# Altium schematic sheet Lights.SchDoc
size 594 x 420 mm; SheetNumber: 4; SheetTotal: 11; SPICEModelCacheKKOZVZNQ: <root> / <DocumentId>KKOZVZNQ</DocumentId> / <CacheFrame Number="0"> / <Model Name="0402_885012205018_100nf" Kind="CKT"> / <Text>******* / .subckt 0402_885012205018_100nF 1 2 / Rser 1 3 0.0183525691398 / Lser 2 4 3.07541467E-10 / C1 3 4 0.0000001 / Rpar 3 4 5000000000 / .ends 0402_885012205018_100nF</Text> / </Model> / </CacheFrame> / </root>
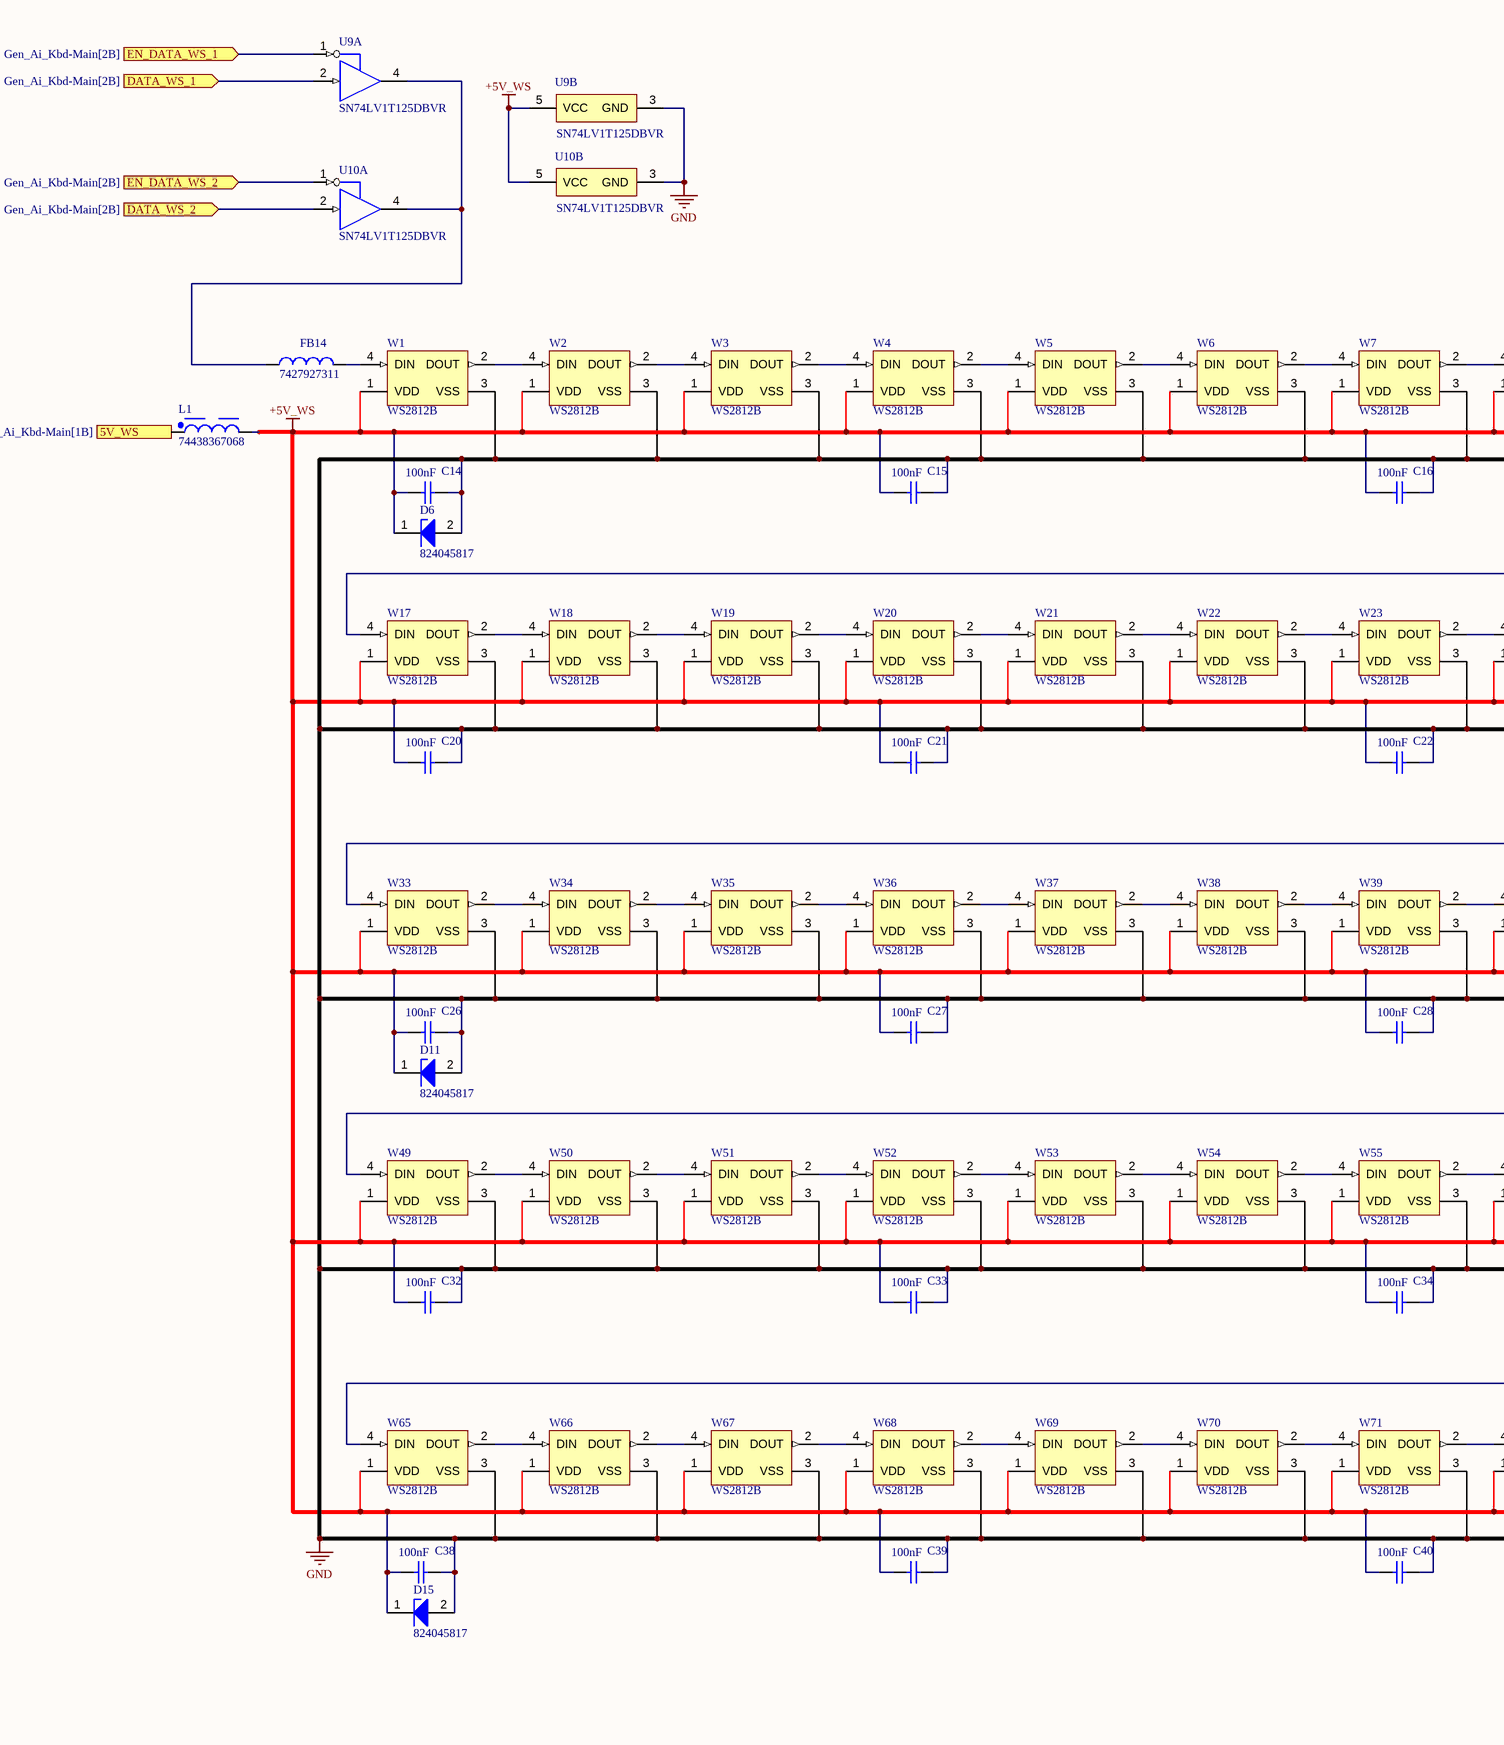
[diagram p0: Lights.SchDoc, left]
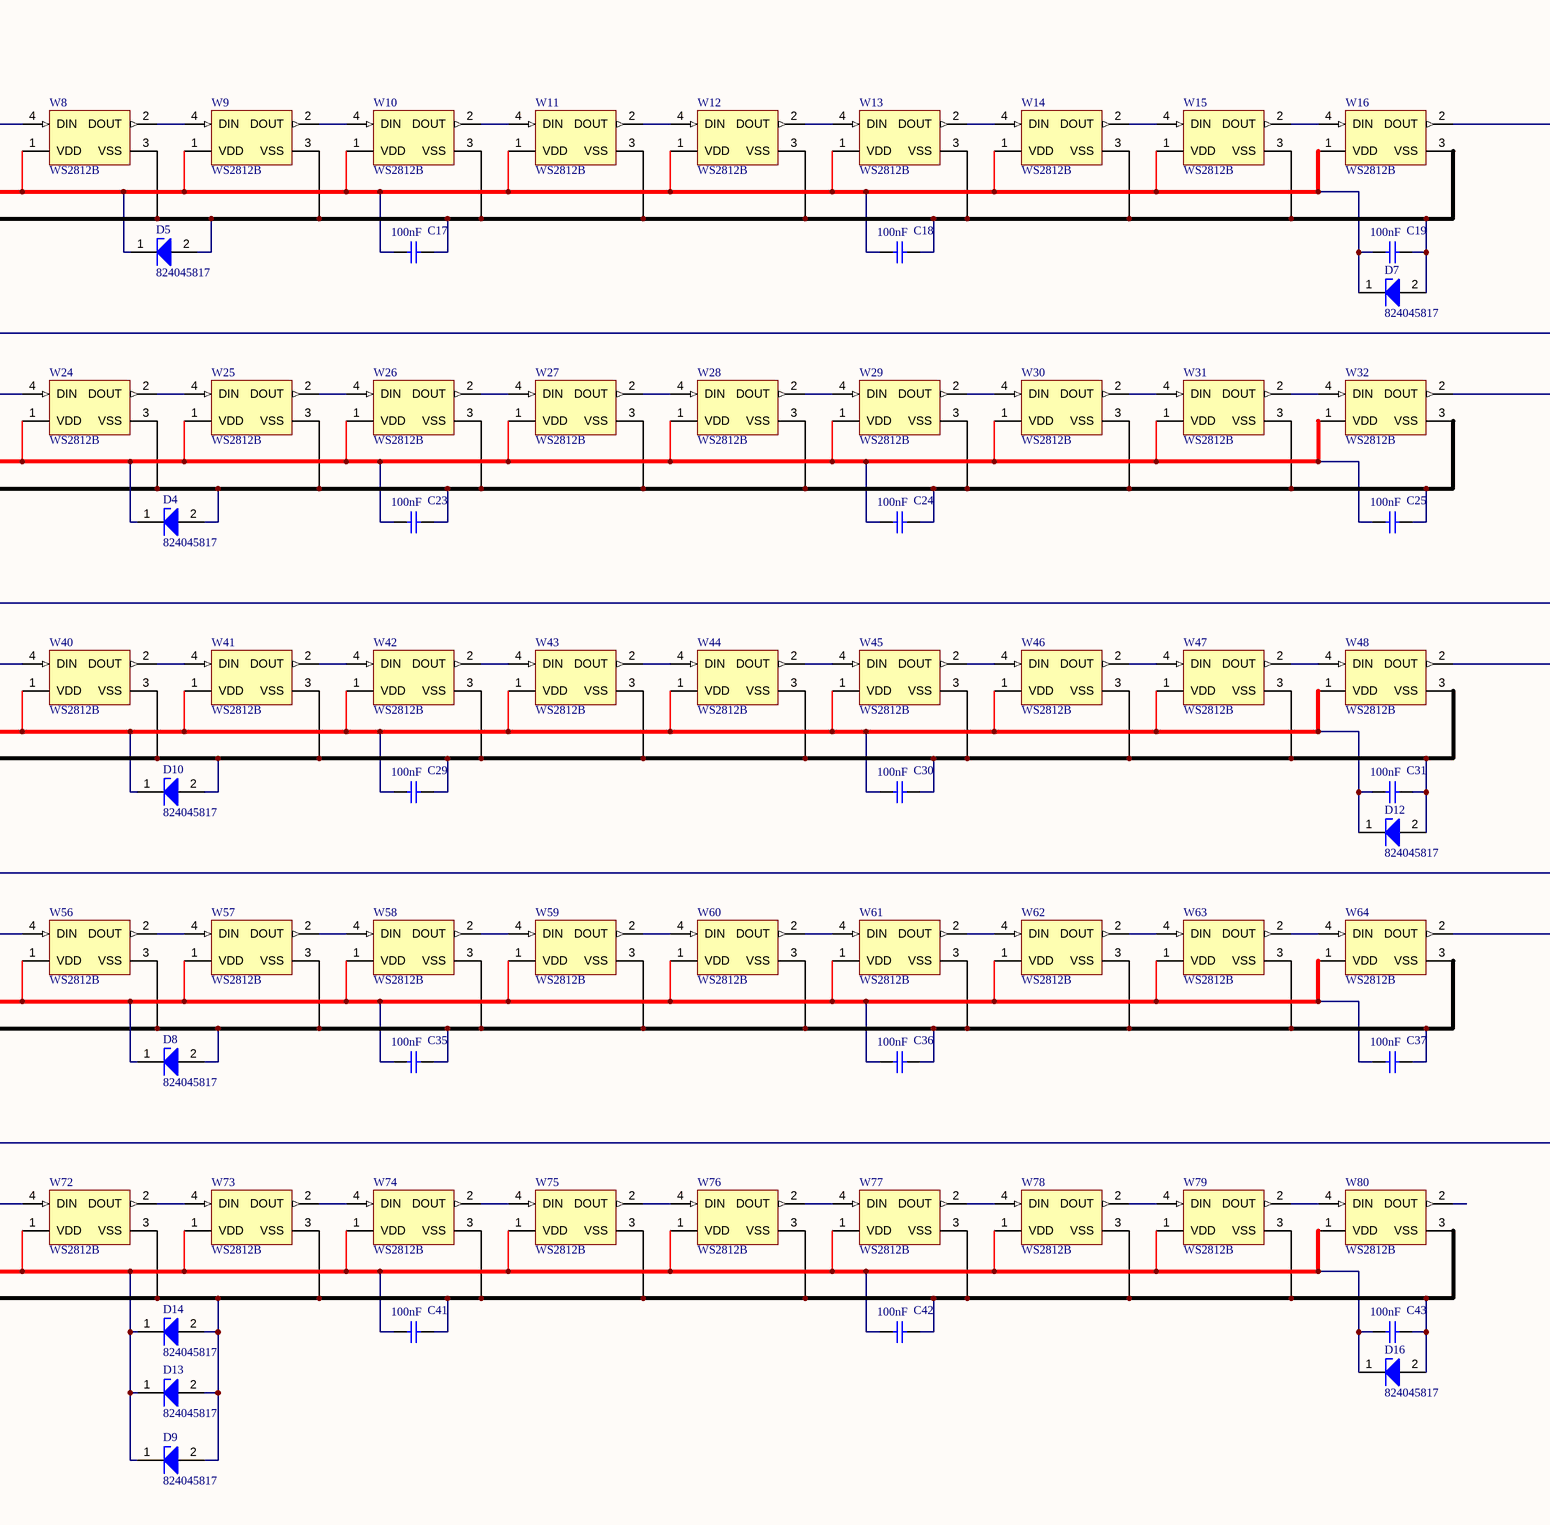
[diagram p1: Lights.SchDoc, right]

## Parts
C14  Capacitance: 100nF  [WCAP-CSGP_0402_L1W0.5H0.5]  (hidden comment: 885012205018)
C15  Capacitance: 100nF  [WCAP-CSGP_0402_L1W0.5H0.5]  (hidden comment: 885012205018)
C16  Capacitance: 100nF  [WCAP-CSGP_0402_L1W0.5H0.5]  (hidden comment: 885012205018)
C17  Capacitance: 100nF  [WCAP-CSGP_0402_L1W0.5H0.5]  (hidden comment: 885012205018)
C18  Capacitance: 100nF  [WCAP-CSGP_0402_L1W0.5H0.5]  (hidden comment: 885012205018)
C19  Capacitance: 100nF  [WCAP-CSGP_0402_L1W0.5H0.5]  (hidden comment: 885012205018)
C20  Capacitance: 100nF  [WCAP-CSGP_0402_L1W0.5H0.5]  (hidden comment: 885012205018)
C21  Capacitance: 100nF  [WCAP-CSGP_0402_L1W0.5H0.5]  (hidden comment: 885012205018)
C22  Capacitance: 100nF  [WCAP-CSGP_0402_L1W0.5H0.5]  (hidden comment: 885012205018)
C23  Capacitance: 100nF  [WCAP-CSGP_0402_L1W0.5H0.5]  (hidden comment: 885012205018)
C24  Capacitance: 100nF  [WCAP-CSGP_0402_L1W0.5H0.5]  (hidden comment: 885012205018)
C25  Capacitance: 100nF  [WCAP-CSGP_0402_L1W0.5H0.5]  (hidden comment: 885012205018)
C26  Capacitance: 100nF  [WCAP-CSGP_0402_L1W0.5H0.5]  (hidden comment: 885012205018)
C27  Capacitance: 100nF  [WCAP-CSGP_0402_L1W0.5H0.5]  (hidden comment: 885012205018)
C28  Capacitance: 100nF  [WCAP-CSGP_0402_L1W0.5H0.5]  (hidden comment: 885012205018)
C29  Capacitance: 100nF  [WCAP-CSGP_0402_L1W0.5H0.5]  (hidden comment: 885012205018)
C30  Capacitance: 100nF  [WCAP-CSGP_0402_L1W0.5H0.5]  (hidden comment: 885012205018)
C31  Capacitance: 100nF  [WCAP-CSGP_0402_L1W0.5H0.5]  (hidden comment: 885012205018)
C32  Capacitance: 100nF  [WCAP-CSGP_0402_L1W0.5H0.5]  (hidden comment: 885012205018)
C33  Capacitance: 100nF  [WCAP-CSGP_0402_L1W0.5H0.5]  (hidden comment: 885012205018)
C34  Capacitance: 100nF  [WCAP-CSGP_0402_L1W0.5H0.5]  (hidden comment: 885012205018)
C35  Capacitance: 100nF  [WCAP-CSGP_0402_L1W0.5H0.5]  (hidden comment: 885012205018)
C36  Capacitance: 100nF  [WCAP-CSGP_0402_L1W0.5H0.5]  (hidden comment: 885012205018)
C37  Capacitance: 100nF  [WCAP-CSGP_0402_L1W0.5H0.5]  (hidden comment: 885012205018)
C38  Capacitance: 100nF  [WCAP-CSGP_0402_L1W0.5H0.5]  (hidden comment: 885012205018)
C39  Capacitance: 100nF  [WCAP-CSGP_0402_L1W0.5H0.5]  (hidden comment: 885012205018)
C40  Capacitance: 100nF  [WCAP-CSGP_0402_L1W0.5H0.5]  (hidden comment: 885012205018)
C41  Capacitance: 100nF  [WCAP-CSGP_0402_L1W0.5H0.5]  (hidden comment: 885012205018)
C42  Capacitance: 100nF  [WCAP-CSGP_0402_L1W0.5H0.5]  (hidden comment: 885012205018)
C43  Capacitance: 100nF  [WCAP-CSGP_0402_L1W0.5H0.5]  (hidden comment: 885012205018)
D4  824045817  [WE-TVS_DFN1610-2L]
D5  824045817  [WE-TVS_DFN1610-2L]
D6  824045817  [WE-TVS_DFN1610-2L]
D7  824045817  [WE-TVS_DFN1610-2L]
D8  824045817  [WE-TVS_DFN1610-2L]
D9  824045817  [WE-TVS_DFN1610-2L]
D10  824045817  [WE-TVS_DFN1610-2L]
D11  824045817  [WE-TVS_DFN1610-2L]
D12  824045817  [WE-TVS_DFN1610-2L]
D13  824045817  [WE-TVS_DFN1610-2L]
D14  824045817  [WE-TVS_DFN1610-2L]
D15  824045817  [WE-TVS_DFN1610-2L]
D16  824045817  [WE-TVS_DFN1610-2L]
FB14  7427927311  [WE-CBF_0402_L1W0.5H0.5_HC]
L1  74438367068  [WE-MAPI_5030]
U9  SN74LV1T125DBVR  [DBV0005A_M]  (parts A,B of 2)
U10  SN74LV1T125DBVR  [DBV0005A_M]  (parts A,B of 2)
W1  WS2812B  [ADA-RGB-1655_V]
W2  WS2812B  [ADA-RGB-1655_V]
W3  WS2812B  [ADA-RGB-1655_V]
W4  WS2812B  [ADA-RGB-1655_V]
W5  WS2812B  [ADA-RGB-1655_V]
W6  WS2812B  [ADA-RGB-1655_V]
W7  WS2812B  [ADA-RGB-1655_V]
W8  WS2812B  [ADA-RGB-1655_V]
W9  WS2812B  [ADA-RGB-1655_V]
W10  WS2812B  [ADA-RGB-1655_V]
W11  WS2812B  [ADA-RGB-1655_V]
W12  WS2812B  [ADA-RGB-1655_V]
W13  WS2812B  [ADA-RGB-1655_V]
W14  WS2812B  [ADA-RGB-1655_V]
W15  WS2812B  [ADA-RGB-1655_V]
W16  WS2812B  [ADA-RGB-1655_V]
W17  WS2812B  [ADA-RGB-1655_V]
W18  WS2812B  [ADA-RGB-1655_V]
W19  WS2812B  [ADA-RGB-1655_V]
W20  WS2812B  [ADA-RGB-1655_V]
W21  WS2812B  [ADA-RGB-1655_V]
W22  WS2812B  [ADA-RGB-1655_V]
W23  WS2812B  [ADA-RGB-1655_V]
W24  WS2812B  [ADA-RGB-1655_V]
W25  WS2812B  [ADA-RGB-1655_V]
W26  WS2812B  [ADA-RGB-1655_V]
W27  WS2812B  [ADA-RGB-1655_V]
W28  WS2812B  [ADA-RGB-1655_V]
W29  WS2812B  [ADA-RGB-1655_V]
W30  WS2812B  [ADA-RGB-1655_V]
W31  WS2812B  [ADA-RGB-1655_V]
W32  WS2812B  [ADA-RGB-1655_V]
W33  WS2812B  [ADA-RGB-1655_V]
W34  WS2812B  [ADA-RGB-1655_V]
W35  WS2812B  [ADA-RGB-1655_V]
W36  WS2812B  [ADA-RGB-1655_V]
W37  WS2812B  [ADA-RGB-1655_V]
W38  WS2812B  [ADA-RGB-1655_V]
W39  WS2812B  [ADA-RGB-1655_V]
W40  WS2812B  [ADA-RGB-1655_V]
W41  WS2812B  [ADA-RGB-1655_V]
W42  WS2812B  [ADA-RGB-1655_V]
W43  WS2812B  [ADA-RGB-1655_V]
W44  WS2812B  [ADA-RGB-1655_V]
W45  WS2812B  [ADA-RGB-1655_V]
W46  WS2812B  [ADA-RGB-1655_V]
W47  WS2812B  [ADA-RGB-1655_V]
W48  WS2812B  [ADA-RGB-1655_V]
W49  WS2812B  [ADA-RGB-1655_V]
W50  WS2812B  [ADA-RGB-1655_V]
W51  WS2812B  [ADA-RGB-1655_V]
W52  WS2812B  [ADA-RGB-1655_V]
W53  WS2812B  [ADA-RGB-1655_V]
W54  WS2812B  [ADA-RGB-1655_V]
W55  WS2812B  [ADA-RGB-1655_V]
W56  WS2812B  [ADA-RGB-1655_V]
W57  WS2812B  [ADA-RGB-1655_V]
W58  WS2812B  [ADA-RGB-1655_V]
W59  WS2812B  [ADA-RGB-1655_V]
W60  WS2812B  [ADA-RGB-1655_V]
W61  WS2812B  [ADA-RGB-1655_V]
W62  WS2812B  [ADA-RGB-1655_V]
W63  WS2812B  [ADA-RGB-1655_V]
W64  WS2812B  [ADA-RGB-1655_V]
W65  WS2812B  [ADA-RGB-1655_V]
W66  WS2812B  [ADA-RGB-1655_V]
W67  WS2812B  [ADA-RGB-1655_V]
W68  WS2812B  [ADA-RGB-1655_V]
W69  WS2812B  [ADA-RGB-1655_V]
W70  WS2812B  [ADA-RGB-1655_V]
W71  WS2812B  [ADA-RGB-1655_V]
W72  WS2812B  [ADA-RGB-1655_V]
W73  WS2812B  [ADA-RGB-1655_V]
W74  WS2812B  [ADA-RGB-1655_V]
W75  WS2812B  [ADA-RGB-1655_V]
W76  WS2812B  [ADA-RGB-1655_V]
W77  WS2812B  [ADA-RGB-1655_V]
W78  WS2812B  [ADA-RGB-1655_V]
W79  WS2812B  [ADA-RGB-1655_V]
W80  WS2812B  [ADA-RGB-1655_V]

## Ports
5V_WS (in, see Gen_Ai_Kbd-Main[1B]), DATA_WS_1 (in, see Gen_Ai_Kbd-Main[2B]), DATA_WS_2 (in, see Gen_Ai_Kbd-Main[2B]), EN_DATA_WS_1 (in, see Gen_Ai_Kbd-Main[2B]), EN_DATA_WS_2 (in, see Gen_Ai_Kbd-Main[2B])

## Nets
+5V_WS: C14.1 C15.1 C16.1 C17.1 C18.1 C19.1 C20.1 C21.1 C22.1 C23.1 C24.1 C25.1 C26.1 C27.1 C28.1 C29.1 C30.1 C31.1 C32.1 C33.1 C34.1 C35.1 C36.1 C37.1 C38.1 C39.1 C40.1 C41.1 C42.1 C43.1 D4.1(I/O_1) D5.1(I/O_1) D6.1(I/O_1) D7.1(I/O_1) D8.1(I/O_1) D9.1(I/O_1) D10.1(I/O_1) D11.1(I/O_1) D12.1(I/O_1) D13.1(I/O_1) D14.1(I/O_1) D15.1(I/O_1) D16.1(I/O_1) L1.2 U9.5(VCC) U10.5(VCC) W1.1(VDD) W2.1(VDD) W3.1(VDD) W4.1(VDD) W5.1(VDD) W6.1(VDD) W7.1(VDD) W8.1(VDD) W9.1(VDD) W10.1(VDD) W11.1(VDD) W12.1(VDD) W13.1(VDD) W14.1(VDD) W15.1(VDD) W16.1(VDD) W17.1(VDD) W18.1(VDD) W19.1(VDD) W20.1(VDD) W21.1(VDD) W22.1(VDD) W23.1(VDD) W24.1(VDD) W25.1(VDD) W26.1(VDD) W27.1(VDD) W28.1(VDD) W29.1(VDD) W30.1(VDD) W31.1(VDD) W32.1(VDD) W33.1(VDD) W34.1(VDD) W35.1(VDD) W36.1(VDD) W37.1(VDD) W38.1(VDD) W39.1(VDD) W40.1(VDD) W41.1(VDD) W42.1(VDD) W43.1(VDD) W44.1(VDD) W45.1(VDD) W46.1(VDD) W47.1(VDD) W48.1(VDD) W49.1(VDD) W50.1(VDD) W51.1(VDD) W52.1(VDD) W53.1(VDD) W54.1(VDD) W55.1(VDD) W56.1(VDD) W57.1(VDD) W58.1(VDD) W59.1(VDD) W60.1(VDD) W61.1(VDD) W62.1(VDD) W63.1(VDD) W64.1(VDD) W65.1(VDD) W66.1(VDD) W67.1(VDD) W68.1(VDD) W69.1(VDD) W70.1(VDD) W71.1(VDD) W72.1(VDD) W73.1(VDD) W74.1(VDD) W75.1(VDD) W76.1(VDD) W77.1(VDD) W78.1(VDD) W79.1(VDD) W80.1(VDD)
GND: C14.2 C15.2 C16.2 C17.2 C18.2 C19.2 C20.2 C21.2 C22.2 C23.2 C24.2 C25.2 C26.2 C27.2 C28.2 C29.2 C30.2 C31.2 C32.2 C33.2 C34.2 C35.2 C36.2 C37.2 C38.2 C39.2 C40.2 C41.2 C42.2 C43.2 D4.2(GND) D5.2(GND) D6.2(GND) D7.2(GND) D8.2(GND) D9.2(GND) D10.2(GND) D11.2(GND) D12.2(GND) D13.2(GND) D14.2(GND) D15.2(GND) D16.2(GND) U9.3(GND) U10.3(GND) W1.3(VSS) W2.3(VSS) W3.3(VSS) W4.3(VSS) W5.3(VSS) W6.3(VSS) W7.3(VSS) W8.3(VSS) W9.3(VSS) W10.3(VSS) W11.3(VSS) W12.3(VSS) W13.3(VSS) W14.3(VSS) W15.3(VSS) W16.3(VSS) W17.3(VSS) W18.3(VSS) W19.3(VSS) W20.3(VSS) W21.3(VSS) W22.3(VSS) W23.3(VSS) W24.3(VSS) W25.3(VSS) W26.3(VSS) W27.3(VSS) W28.3(VSS) W29.3(VSS) W30.3(VSS) W31.3(VSS) W32.3(VSS) W33.3(VSS) W34.3(VSS) W35.3(VSS) W36.3(VSS) W37.3(VSS) W38.3(VSS) W39.3(VSS) W40.3(VSS) W41.3(VSS) W42.3(VSS) W43.3(VSS) W44.3(VSS) W45.3(VSS) W46.3(VSS) W47.3(VSS) W48.3(VSS) W49.3(VSS) W50.3(VSS) W51.3(VSS) W52.3(VSS) W53.3(VSS) W54.3(VSS) W55.3(VSS) W56.3(VSS) W57.3(VSS) W58.3(VSS) W59.3(VSS) W60.3(VSS) W61.3(VSS) W62.3(VSS) W63.3(VSS) W64.3(VSS) W65.3(VSS) W66.3(VSS) W67.3(VSS) W68.3(VSS) W69.3(VSS) W70.3(VSS) W71.3(VSS) W72.3(VSS) W73.3(VSS) W74.3(VSS) W75.3(VSS) W76.3(VSS) W77.3(VSS) W78.3(VSS) W79.3(VSS) W80.3(VSS)
5V_WS: L1.1 ; port 5V_WS
DATA_WS_1: U9.2(A) ; port DATA_WS_1
DATA_WS_2: U10.2(A) ; port DATA_WS_2
EN_DATA_WS_1: U9.1(~{OE}) ; port EN_DATA_WS_1
EN_DATA_WS_2: U10.1(~{OE}) ; port EN_DATA_WS_2
NetFB14_1: FB14.1 U9.4(Y) U10.4(Y)
NetFB14_2: FB14.2 W1.4(DIN)
NetW1_2: W1.2(DOUT) W2.4(DIN)
NetW2_2: W2.2(DOUT) W3.4(DIN)
NetW3_2: W3.2(DOUT) W4.4(DIN)
NetW4_2: W4.2(DOUT) W5.4(DIN)
NetW5_2: W5.2(DOUT) W6.4(DIN)
NetW6_2: W6.2(DOUT) W7.4(DIN)
NetW7_2: W7.2(DOUT) W8.4(DIN)
NetW8_2: W8.2(DOUT) W9.4(DIN)
NetW9_2: W9.2(DOUT) W10.4(DIN)
NetW10_2: W10.2(DOUT) W11.4(DIN)
NetW11_2: W11.2(DOUT) W12.4(DIN)
NetW12_2: W12.2(DOUT) W13.4(DIN)
NetW13_2: W13.2(DOUT) W14.4(DIN)
NetW14_2: W14.2(DOUT) W15.4(DIN)
NetW15_2: W15.2(DOUT) W16.4(DIN)
NetW16_2: W16.2(DOUT) W17.4(DIN)
NetW17_2: W17.2(DOUT) W18.4(DIN)
NetW18_2: W18.2(DOUT) W19.4(DIN)
NetW19_2: W19.2(DOUT) W20.4(DIN)
NetW20_2: W20.2(DOUT) W21.4(DIN)
NetW21_2: W21.2(DOUT) W22.4(DIN)
NetW22_2: W22.2(DOUT) W23.4(DIN)
NetW23_2: W23.2(DOUT) W24.4(DIN)
NetW24_2: W24.2(DOUT) W25.4(DIN)
NetW25_2: W25.2(DOUT) W26.4(DIN)
NetW26_2: W26.2(DOUT) W27.4(DIN)
NetW27_2: W27.2(DOUT) W28.4(DIN)
NetW28_2: W28.2(DOUT) W29.4(DIN)
NetW29_2: W29.2(DOUT) W30.4(DIN)
NetW30_2: W30.2(DOUT) W31.4(DIN)
NetW31_2: W31.2(DOUT) W32.4(DIN)
NetW32_2: W32.2(DOUT) W33.4(DIN)
NetW33_2: W33.2(DOUT) W34.4(DIN)
NetW34_2: W34.2(DOUT) W35.4(DIN)
NetW35_2: W35.2(DOUT) W36.4(DIN)
NetW36_2: W36.2(DOUT) W37.4(DIN)
NetW37_2: W37.2(DOUT) W38.4(DIN)
NetW38_2: W38.2(DOUT) W39.4(DIN)
NetW39_2: W39.2(DOUT) W40.4(DIN)
NetW40_2: W40.2(DOUT) W41.4(DIN)
NetW41_2: W41.2(DOUT) W42.4(DIN)
NetW42_2: W42.2(DOUT) W43.4(DIN)
NetW43_2: W43.2(DOUT) W44.4(DIN)
NetW44_2: W44.2(DOUT) W45.4(DIN)
NetW45_2: W45.2(DOUT) W46.4(DIN)
NetW46_2: W46.2(DOUT) W47.4(DIN)
NetW47_2: W47.2(DOUT) W48.4(DIN)
NetW48_2: W48.2(DOUT) W49.4(DIN)
NetW49_2: W49.2(DOUT) W50.4(DIN)
NetW50_2: W50.2(DOUT) W51.4(DIN)
NetW51_2: W51.2(DOUT) W52.4(DIN)
NetW52_2: W52.2(DOUT) W53.4(DIN)
NetW53_2: W53.2(DOUT) W54.4(DIN)
NetW54_2: W54.2(DOUT) W55.4(DIN)
NetW55_2: W55.2(DOUT) W56.4(DIN)
NetW56_2: W56.2(DOUT) W57.4(DIN)
NetW57_2: W57.2(DOUT) W58.4(DIN)
NetW58_2: W58.2(DOUT) W59.4(DIN)
NetW59_2: W59.2(DOUT) W60.4(DIN)
NetW60_2: W60.2(DOUT) W61.4(DIN)
NetW61_2: W61.2(DOUT) W62.4(DIN)
NetW62_2: W62.2(DOUT) W63.4(DIN)
NetW63_2: W63.2(DOUT) W64.4(DIN)
NetW64_2: W64.2(DOUT) W65.4(DIN)
NetW65_2: W65.2(DOUT) W66.4(DIN)
NetW66_2: W66.2(DOUT) W67.4(DIN)
NetW67_2: W67.2(DOUT) W68.4(DIN)
NetW68_2: W68.2(DOUT) W69.4(DIN)
NetW69_2: W69.2(DOUT) W70.4(DIN)
NetW70_2: W70.2(DOUT) W71.4(DIN)
NetW71_2: W71.2(DOUT) W72.4(DIN)
NetW72_2: W72.2(DOUT) W73.4(DIN)
NetW73_2: W73.2(DOUT) W74.4(DIN)
NetW74_2: W74.2(DOUT) W75.4(DIN)
NetW75_2: W75.2(DOUT) W76.4(DIN)
NetW76_2: W76.2(DOUT) W77.4(DIN)
NetW77_2: W77.2(DOUT) W78.4(DIN)
NetW78_2: W78.2(DOUT) W79.4(DIN)
NetW79_2: W79.2(DOUT) W80.4(DIN)

Not connected (* = marked no-connect by the designer): W80 2(DOUT)

## Notes on the sheet
- DWG NO:
- REV:
- REVISION
- DESCRIPTION
- DATE
- APPROVED
- PROJECT
- sumasta
- t
- PROJECT REVISION:
- TITLE
- DOCUMENT REVISION:
- DESIGN ITEM:
- SCALE:
- A2
- SIZE
- CAGE CODE
- FILE NAME
- DWG NO.
- SHEET
- OF
- REV

## Library data of the parts
C14-C43 = CMP-007-000501-1: WCAP-CSGP Multilayer Ceramic Chip Capacitor, General Purpose, size 0402, X7R, 100nF, 10VDC; Manufacturer: Wurth Elektronik; Case/Size Code: 0402; Rated Voltage (DC): 10V; Capacitance Tolerance: +/-10%; Insulation Resistance: 5GO; Technical Reference: X7R0402104K010DFCT10000; Dissipation Factor: 5%; ComponentLink2Description: Datasheet Link; Operating Temperature Min: -55°C; ComponentLink1URL: https://www.we-online.com/redexpert/article/885012205018?ad; Pin Count: 2; Component Type: Standard; Manufacturer Part Number: 885012205018; Category: Multilayer Ceramic Chip Capacitors; Height: 0.5mm; Ceramic Type: X7R; ComponentLink2URL: https://www.we-online.com/redexpert/spec/885012205018?ad; Packaging: Tape and Reel; ComponentLink1Description: Website Link; Length: 1mm; Design Item ID: 885012205018; Source: WCAP-CSGP.SchLib; Match Code: WCAP-CSGP; Operating Temperature Max: 125°C; Mount: Surface Mount; Width: 0.5mm
D4-D16 = CMP-03913-128281014-1: 824045817 Tvs Diode, Unidir, 7V, Dfn1610 Rohs Compliant: Yes; Leakage Current: 1µA; Forward Voltage: 800mV; Min Operating Temperature: -55°C; Width: 1mm; RoHS: Compliant; Length: 1.6mm; Max Operating Temperature: 85°C; NexarPartId: 128281014; Height: 500µm
FB14 = CMP-0220-00132-2: NexarPartId: 19122429; Max Current Rating: 1.2A; Impedance: 120Ω; Number of Lines: 1; Tolerance: 25%; DC Resistance (DCR): 90mΩ; Test Frequency: 100MHz; Height: 500µm; Material: Ferrite; Width: 500µm; Mount: Surface Mount; Case/Package: SMD/SMT; Max Operating Temperature: 125°C; Current Rating: 1.2A; Case Code (Imperial): 0402; RoHS: Compliant; REACH SVHC: Unknown; Depth: 500µm; Max DC Current: 1.2A; Case Code (Metric): 1005; Length: 1mm; Termination: SMD/SMT; Packaging: Digi-Reel®; Lead Free: Lead Free; Min Operating Temperature: -55°C
L1 = CMP-03913-130924347-1: 74438367068 Power Inductor, 6.8Uh, Shielded, 5.7A Rohs Compliant: Yes; Inductance: 6.8µH; DC Resistance (DCR): 42mΩ; Current Rating: 4.3A; Min Operating Temperature: -40°C; Ambient Temperature Range High: 85°C; NexarPartId: 130924347; Width: 5.4mm; Ambient Temperature Range Low: -40°C; RoHS: Compliant; Height: 3.1mm; Length: 5.4mm; Max Operating Temperature: 125°C
U9 U10 = CMP-0859-00122-3: Single Power Supply, Single BUFFER GATE w/ 3-State Output (active low enable), DBV0005A, LARGE T&R; Manufacturer: Texas Instruments; Schmitt Trigger: No; Sub-Family: Non-Inverting Buffer/Driver; Voltage(Nom)(V): 1.8,2.5,3.3,5.5; Output Drive (IOL/IOH)(Max)(mA): 8/-8; Bits(#): 1; Technology Family: LV1T; F @ Nom Voltage(Max)(Mhz): 50; Output Type: CMOS; Input Type: TTL; VCC(Min)(V): 1.6; tpd @ Nom Voltage(Max)(ns): 14.5,9.5,8.0,6.5; 3-State Output: Yes; ICC @ Nom Voltage(Max)(mA): 0.01; Rating: Catalog; Logic: True; Special Features: 1.8V to 3.3V Up Translation,3.3V to 1.8V Down Translation,5V Input Tolerant; VCC(Max)(V): 5.5; PackageReference: DBV0005A; Generic Part Number: SN74LV1T125; Operating Temperature Range(C): -40 to 125; DatasheetVersion: SCLS745A
W1-W80 = CMP-00026-00001-1: NeoPixel 5050 RGB LED with Integrated Driver Chip - 10 Pack